# Altium schematic sheet ADE7753.SchDoc
size A4; SheetNumber: 3; SheetTotal: 6
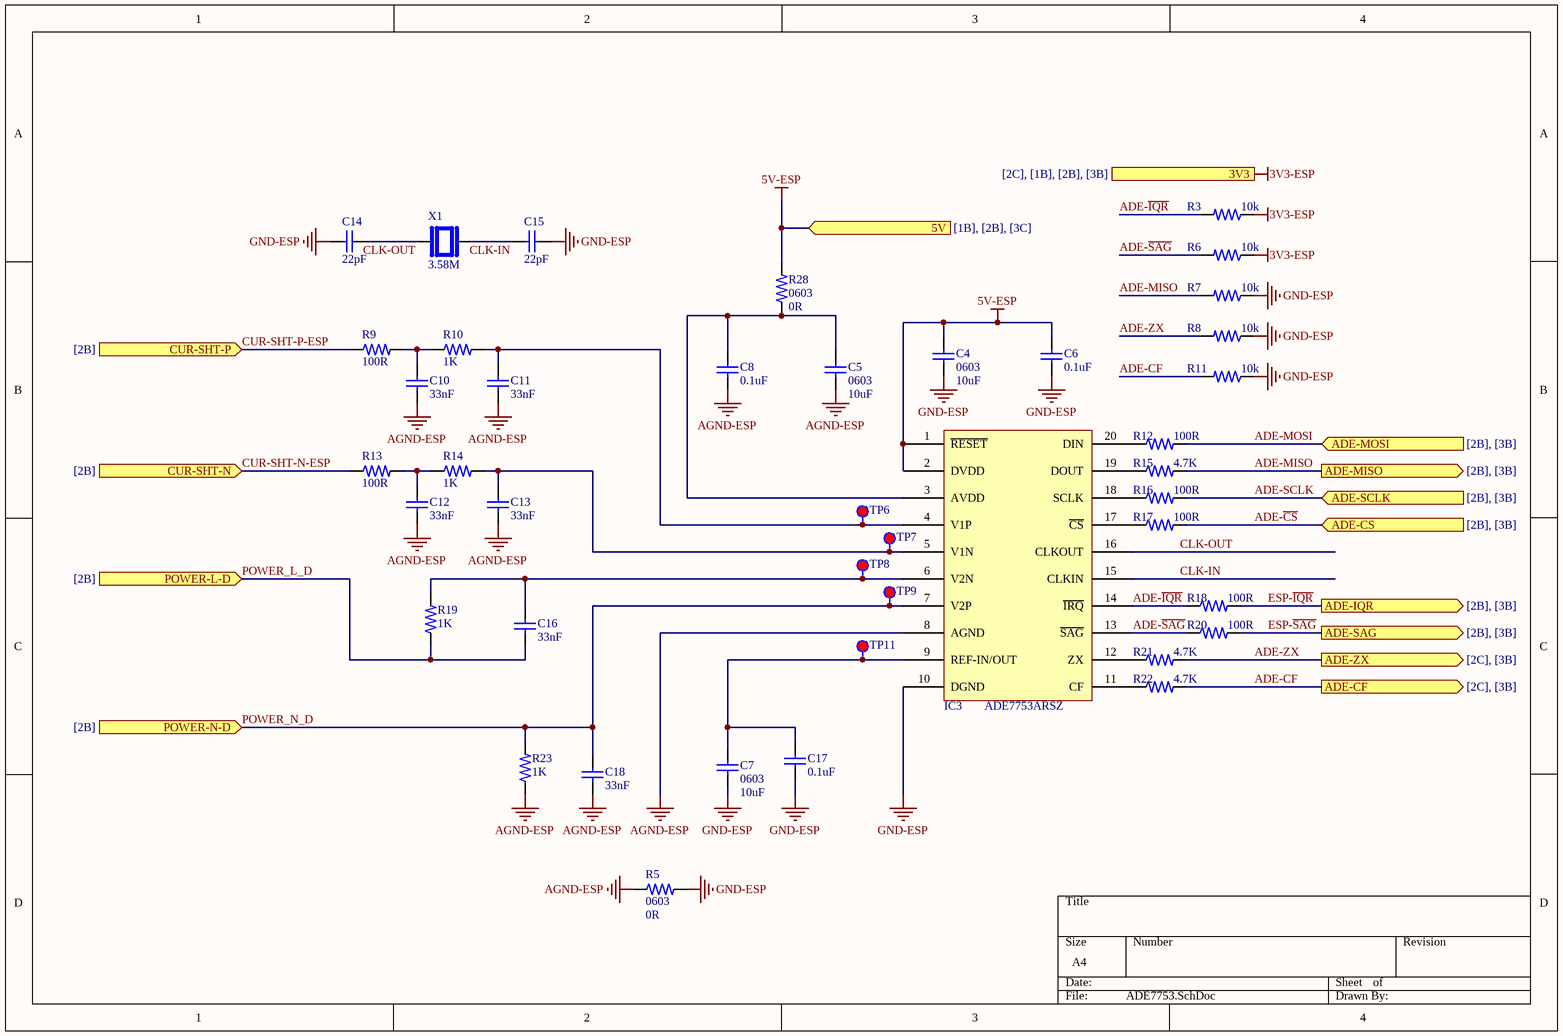
[diagram p0: ADE7753.SchDoc]

## Parts
C4  value 10uF  Package: 0603  [SMD-CAP-0603-YAGEO]  (hidden comment: 10 µF ±20% 25V Ceramic Capacitor X5R 0603 (1608 Metric))
C5  value 10uF  Package: 0603  [SMD-CAP-0603-YAGEO]  (hidden comment: 10 µF ±20% 25V Ceramic Capacitor X5R 0603 (1608 Metric))
C6  value 0.1uF  [SMD-CAP-0603-YAGEO]  (hidden comment: 0.1 µF ±10% 16V Ceramic Capacitor X7R 0603 (1608 Metric))
C7  value 10uF  Package: 0603  [SMD-CAP-0603-YAGEO]  (hidden comment: 10 µF ±20% 25V Ceramic Capacitor X5R 0603 (1608 Metric))
C8  value 0.1uF  [SMD-CAP-0603-YAGEO]  (hidden comment: 0.1 µF ±10% 16V Ceramic Capacitor X7R 0603 (1608 Metric))
C10  value 33nF  [SMD-CAP-0603-KEMET]  (hidden comment: 0.033 µF ±5% 16V Ceramic Capacitor X7R 0603 (1608 Metric))
C11  value 33nF  [SMD-CAP-0603-KEMET]  (hidden comment: 0.033 µF ±5% 16V Ceramic Capacitor X7R 0603 (1608 Metric))
C12  value 33nF  [SMD-CAP-0603-KEMET]  (hidden comment: 0.033 µF ±5% 16V Ceramic Capacitor X7R 0603 (1608 Metric))
C13  value 33nF  [SMD-CAP-0603-KEMET]  (hidden comment: 0.033 µF ±5% 16V Ceramic Capacitor X7R 0603 (1608 Metric))
C14  value 22pF  [SMD-CAP-0603-YAGEO]  (hidden comment: 22 pF ±1% 50V Ceramic Capacitor C0G, NP0 0603 (1608 Metric))
C15  value 22pF  [SMD-CAP-0603-YAGEO]  (hidden comment: 22 pF ±1% 50V Ceramic Capacitor C0G, NP0 0603 (1608 Metric))
C16  value 33nF  [SMD-CAP-0603-KEMET]  (hidden comment: 0.033 µF ±5% 16V Ceramic Capacitor X7R 0603 (1608 Metric))
C17  value 0.1uF  [SMD-CAP-0603-YAGEO]  (hidden comment: 0.1 µF ±10% 16V Ceramic Capacitor X7R 0603 (1608 Metric))
C18  value 33nF  [SMD-CAP-0603-KEMET]  (hidden comment: 0.033 µF ±5% 16V Ceramic Capacitor X7R 0603 (1608 Metric))
IC3  Single Phase Meter IC 20-SSOP  [SSOP-20-ADI]  (value not drawn)
R3  value 10k  [SMD-RES-0603-SEI]  (hidden comment: 10 kOhms ±1% 0.25W, 1/4W Chip Resistor 0603 (1608 Metric) Automotive AEC-Q200, Pulse Withstanding Thick Film)
R5  value 0R  Package: 0603  [SMD-RES-0603-SEI]  (hidden comment: 0 Ohms Jumper Chip Resistor 0603 (1608 Metric) Automotive AEC-Q200 Thick Film)
R6  value 10k  [SMD-RES-0603-SEI]  (hidden comment: 10 kOhms ±1% 0.25W, 1/4W Chip Resistor 0603 (1608 Metric) Automotive AEC-Q200, Pulse Withstanding Thick Film)
R7  value 10k  [SMD-RES-0603-SEI]  (hidden comment: 10 kOhms ±1% 0.25W, 1/4W Chip Resistor 0603 (1608 Metric) Automotive AEC-Q200, Pulse Withstanding Thick Film)
R8  value 10k  [SMD-RES-0603-SEI]  (hidden comment: 10 kOhms ±1% 0.25W, 1/4W Chip Resistor 0603 (1608 Metric) Automotive AEC-Q200, Pulse Withstanding Thick Film)
R9  value 100R  [SMD-RES-0603-RS]  (hidden comment: 100 Ohms ±1% 0.1W, 1/10W Chip Resistor 0603 (1608 Metric) Automotive AEC-Q200, High Voltage Thick Film)
R10  value 1K  [SMD-RES-0603-SEI]  (hidden comment: 1 kOhms ±1% 0.25W, 1/4W Chip Resistor 0603 (1608 Metric) Automotive AEC-Q200, Pulse Withstanding Thick Film)
R11  value 10k  [SMD-RES-0603-SEI]  (hidden comment: 10 kOhms ±1% 0.25W, 1/4W Chip Resistor 0603 (1608 Metric) Automotive AEC-Q200, Pulse Withstanding Thick Film)
R12  value 100R  [SMD-RES-0603-RS]  (hidden comment: 100 Ohms ±1% 0.1W, 1/10W Chip Resistor 0603 (1608 Metric) Automotive AEC-Q200, High Voltage Thick Film)
R13  value 100R  [SMD-RES-0603-RS]  (hidden comment: 100 Ohms ±1% 0.1W, 1/10W Chip Resistor 0603 (1608 Metric) Automotive AEC-Q200, High Voltage Thick Film)
R14  value 1K  [SMD-RES-0603-SEI]  (hidden comment: 1 kOhms ±1% 0.25W, 1/4W Chip Resistor 0603 (1608 Metric) Automotive AEC-Q200, Pulse Withstanding Thick Film)
R15  value 4.7K  [SMD-RES-0603-RS]  (hidden comment: 4.7 kOhms ±1% 0.1W, 1/10W Chip Resistor 0603 (1608 Metric) Anti-Sulfur Thick Film)
R16  value 100R  [SMD-RES-0603-RS]  (hidden comment: 100 Ohms ±1% 0.1W, 1/10W Chip Resistor 0603 (1608 Metric) Automotive AEC-Q200, High Voltage Thick Film)
R17  value 100R  [SMD-RES-0603-RS]  (hidden comment: 100 Ohms ±1% 0.1W, 1/10W Chip Resistor 0603 (1608 Metric) Automotive AEC-Q200, High Voltage Thick Film)
R18  value 100R  [SMD-RES-0603-RS]  (hidden comment: 100 Ohms ±1% 0.1W, 1/10W Chip Resistor 0603 (1608 Metric) Automotive AEC-Q200, High Voltage Thick Film)
R19  value 1K  [SMD-RES-0603-SEI]  (hidden comment: 1 kOhms ±1% 0.25W, 1/4W Chip Resistor 0603 (1608 Metric) Automotive AEC-Q200, Pulse Withstanding Thick Film)
R20  value 100R  [SMD-RES-0603-RS]  (hidden comment: 100 Ohms ±1% 0.1W, 1/10W Chip Resistor 0603 (1608 Metric) Automotive AEC-Q200, High Voltage Thick Film)
R21  value 4.7K  [SMD-RES-0603-RS]  (hidden comment: 4.7 kOhms ±1% 0.1W, 1/10W Chip Resistor 0603 (1608 Metric) Anti-Sulfur Thick Film)
R22  value 4.7K  [SMD-RES-0603-RS]  (hidden comment: 4.7 kOhms ±1% 0.1W, 1/10W Chip Resistor 0603 (1608 Metric) Anti-Sulfur Thick Film)
R23  value 1K  [SMD-RES-0603-SEI]  (hidden comment: 1 kOhms ±1% 0.25W, 1/4W Chip Resistor 0603 (1608 Metric) Automotive AEC-Q200, Pulse Withstanding Thick Film)
R28  value 0R  Package: 0603  [SMD-RES-0603-SEI]  (hidden comment: 0 Ohms Jumper Chip Resistor 0603 (1608 Metric) Automotive AEC-Q200 Thick Film)
TP6  Test Point  [TEST_POINT]  (value not drawn)
TP7  Test Point  [TEST_POINT]  (value not drawn)
TP8  Test Point  [TEST_POINT]  (value not drawn)
TP9  Test Point  [TEST_POINT]  (value not drawn)
TP11  Test Point  [TEST_POINT]  (value not drawn)
X1  value 3.58M  [SMD-HC-49/US-ALLC]  (hidden comment: 3.579545 MHz ±20ppm Crystal 18pF 180 Ohms HC-49/US)

## Ports
3V3 (in, see [2C], [1B], [2B], [3B]), 5V (in, see [1B], [2B], [3C]), ADE-CF (out, see [2C], [3B]), ADE-CS (in, see [2B], [3B]), ADE-IQR (out, see [2B], [3B]), ADE-MISO (out, see [2B], [3B]), ADE-MOSI (in, see [2B], [3B]), ADE-SAG (out, see [2B], [3B]), ADE-SCLK (in, see [2B], [3B]), ADE-ZX (out, see [2C], [3B]), CUR-SHT-N (in, see [2B]), CUR-SHT-P (in, see [2B]), POWER-L-D (in, see [2B]), POWER-N-D (in, see [2B])

## Nets
3V3-ESP: R3.1 R6.1 ; port 3V3
5V-ESP: C4.2 C6.2 IC3.1(~{RESET}) IC3.2(DVDD) R28.2 ; port 5V
AGND-ESP: C5.1 C8.1 C10.1 C11.1 C12.1 C13.1 C18.1 IC3.8(AGND) R5.1 R23.1
GND-ESP: C4.1 C6.1 C7.1 C14.1 C15.2 C17.1 IC3.10(DGND) R5.2 R7.1 R8.1 R11.1
ADE-~{CS}: R17.2 ; port ADE-CS
ADE-CF: R11.2 R22.2 ; port ADE-CF
ADE-~{IQR}: IC3.14(~{IRQ}) R3.2 R18.1
ADE-MISO: R7.2 R15.2 ; port ADE-MISO
ADE-MOSI: R12.2 ; port ADE-MOSI
ADE-~{SAG}: IC3.13(~{SAG}) R6.2 R20.1
ADE-SCLK: R16.2 ; port ADE-SCLK
ADE-ZX: R8.2 R21.2 ; port ADE-ZX
CLK-IN: C15.1 IC3.15(CLKIN) X1.2
CLK-OUT: C14.2 IC3.16(CLKOUT) X1.1
CUR-SHT-N-ESP: R13.1 ; port CUR-SHT-N
CUR-SHT-P-ESP: R9.1 ; port CUR-SHT-P
ESP-~{IQR}: R18.2 ; port ADE-IQR
ESP-~{SAG}: R20.2 ; port ADE-SAG
POWER_L_D: C16.1 R19.1 ; port POWER-L-D
POWER_N_D: C18.2 IC3.7(V2P) R23.2 TP9.1 ; port POWER-N-D
NetC5_2: C5.2 C8.2 IC3.3(AVDD) R28.1
NetC7_2: C7.2 C17.2 IC3.9(REF-IN/OUT) TP11.1
NetC10_2: C10.2 R9.2 R10.1
NetC11_2: C11.2 IC3.4(V1P) R10.2 TP6.1
NetC12_2: C12.2 R13.2 R14.1
NetC13_2: C13.2 IC3.5(V1N) R14.2 TP7.1
NetC16_2: C16.2 IC3.6(V2N) R19.2 TP8.1
NetIC3_11: IC3.11(CF) R22.1
NetIC3_12: IC3.12(ZX) R21.1
NetIC3_17: IC3.17(~{CS}) R17.1
NetIC3_18: IC3.18(SCLK) R16.1
NetIC3_19: IC3.19(DOUT) R15.1
NetIC3_20: IC3.20(DIN) R12.1

## Library data of the parts
C4 C5 C7 = CAP; 10uF; 25V; SMD; 0603; CC0603MRX5R8BB106: Multilayer Ceramic Capacitor, 10 uF, 25 V, ï¿½ 20%, X5R, 0603 [1608 Metric]; Manufacturer: Yageo; Designer: TVBac; Supplier: Future Electronics; Supplier Part Number: 3086968; Manufacturer Part Number: CC0603MRX5R8BB106; RoHS: Yes; Category: Ceramic Capacitors; Stock: 296000; Pricing: 4000=0.155, 8000=0.153, 12000=0.151 (USD); Mounting Technology: Surface Mount; Case/Package: 0603; Case Code (Imperial): 0603; Case Code (Metric): 1608; Min Operating Temperature: -55°C; Max Operating Temperature: 85°C; Packaging: Cut Tape; Tolerance: 20%; Voltage Rating: 25V; Series: CC; Dielectric: X5R; Voltage Rating (DC): 25V; RoHS Compliant: Yes; Halogen Free: Halogen Free; Lead Free: Lead Free; ComponentLink1URL: https://www.yageo.com/upload/media/product/productsearch/datasheet/mlcc/UPY-GPHC_X5R_4V-to-50V_26.pdf?src-supplier=Digikey; ComponentLink1Description: https://www.yageo.com/upload/media/product/productsearch/datasheet/mlcc/UPY-GPHC_X5R_4V-to-50V_26.pdf?src-supplier=Digikey; ComponentLink2URL: https://datasheet.octopart.com/CC0603MRX5R8BB106-Yageo-datasheet-182965619.pdf?src-supplier=Farnell; ComponentLink2Description: https://datasheet.octopart.com/CC0603MRX5R8BB106-Yageo-datasheet-182965619.pdf?src-supplier=Farnell; ComponentLink3Description: Link Digikey; ComponentLink3URL: https://www.digikey.com/en/products/detail/yageo/CC0603MRX5R8BB106/7164378
C6 C8 C17 = CAP; 0.1uF; 16V; 0603; SMD; CC0603KRX7R7BB104: 0603 0.1 uF 16 V ±10 % Tolerance X7R SMT Multilayer Ceramic Capacitor; Manufacturer: Yageo; Insulation Resistance: 100GR; Designer: TVBac; Supplier: Digikey; Supplier Part Number: 311-1088-1-ND; Manufacturer Part Number: CC0603KRX7R7BB104; RoHS: Yes; Category: Ceramic Capacitors; Stock: 8705780; Pricing: 1=0.1, 10=0.042, 50=0.0238, 100=0.0185, 500=0.01392, 1000=0.01094, 4000=0.00915, 8000=0.00836, 12000=0.00796, 28000=0.00756, 100000=0.00547, 200000=0.00529, 400000=0.00497 (USD); Mounting Technology: Surface Mount; Case/Package: 0603; Pins: 2; Case Code (Metric): 1608; Case Code (Imperial): 0603; Material: Ceramic; Min Operating Temperature: -55°C; Max Operating Temperature: 125°C; Voltage Rating: 16V; Tolerance: 10%; Voltage Rating (DC): 16V; Package Quantity: 1; Packaging: Tape and Reel; Dielectric: X7R; Termination: SMD/SMT; Voltage: 16V; Series: CC; Length: 1.6mm; Width: 0.031inch; Height: 0.8mm; Thickness: 0.035inch; Depth: 0.8mm; Radiation Hardening: No; Reach SVHC Compliant: No; Lead Free: Lead Free; Halogen Free: Halogen Free; RoHS Compliant: Yes; ComponentLink1URL: https://datasheet.ciiva.com/11786/0900766b80d84f1d-11786077.pdf?src-supplier=Rs; ComponentLink1Description: https://datasheet.ciiva.com/11786/0900766b80d84f1d-11786077.pdf?src-supplier=Rs; ComponentLink2URL: https://datasheet.ciiva.com/8033/70765-8033799.pdf?src-supplier=Element14; ComponentLink2Description: https://datasheet.ciiva.com/8033/70765-8033799.pdf?src-supplier=Element14; ComponentLink3URL: https://datasheet.ciiva.com/7978/1489800-7978141.pdf?src-supplier=Element14; ComponentLink3Description: https://datasheet.ciiva.com/7978/1489800-7978141.pdf?src-supplier=Element14; ComponentLink4URL: https://datasheet.ciiva.com/28450/1489800-28450552.pdf?src-supplier=Element14; ComponentLink4Description: https://datasheet.ciiva.com/28450/1489800-28450552.pdf?src-supplier=Element14; ComponentLink5URL: https://datasheet.ciiva.com/46430/1734573-46430156.pdf?src-supplier=Element14; ComponentLink5Description: https://datasheet.ciiva.com/46430/1734573-46430156.pdf?src-supplier=Element14; ComponentLink6URL: https://datasheet.ciiva.com/144/mlccorderingcode-144183.pdf?src-supplier=Digikey; ComponentLink6Description: https://datasheet.ciiva.com/144/mlccorderingcode-144183.pdf?src-supplier=Digikey; ComponentLink7URL: https://datasheet.ciiva.com/144/mlccorderingcode-144182.pdf?src-supplier=Digikey; ComponentLink7Description: https://datasheet.ciiva.com/144/mlccorderingcode-144182.pdf?src-supplier=Digikey; ComponentLink8URL: https://datasheet.ciiva.com/144/mlccorderingcode-144184.pdf?src-supplier=Digikey; ComponentLink8Description: https://datasheet.ciiva.com/144/mlccorderingcode-144184.pdf?src-supplier=Digikey; ComponentLink9URL: https://datasheet.ciiva.com/8033/1734573-8033797.pdf?src-supplier=Element14; ComponentLink9Description: https://datasheet.ciiva.com/8033/1734573-8033797.pdf?src-supplier=Element14; ComponentLink10URL: https://datasheet.ciiva.com/13395/upy-gphc-x7r-6-3v-to-50v-8-13395674.pdf?src-supplier=Mouser; ComponentLink10Description: https://datasheet.ciiva.com/13395/upy-gphc-x7r-6-3v-to-50v-8-13395674.pdf?src-supplier=Mouser; ComponentLink11URL: https://datasheet.ciiva.com/11464/upy-gphc-x7r-6-3v-to-50v-8-11464735.pdf?src-supplier=Avnet; ComponentLink11Description: https://datasheet.ciiva.com/11464/upy-gphc-x7r-6-3v-to-50v-8-11464735.pdf?src-supplier=Avnet; ComponentLink12URL: https://datasheet.ciiva.com/15165/getdatasheetpartid-63554-15165387.pdf?src-supplier=Verical; ComponentLink12Description: https://datasheet.ciiva.com/15165/getdatasheetpartid-63554-15165387.pdf?src-supplier=Verical; ComponentLink13Description: Link Digikey; ComponentLink13URL: https://www.digikey.com/en/products/detail/yageo/CC0603KRX7R7BB104/302822
C10-C13 C16 C18 = CAP; 0.033uF; 33nF; 0603; 16V; C0603C333J4REC7411: Multilayer Ceramic Capacitors MLCC - SMD/SMT 16V 0.033uF X7R 0603 5%; Manufacturer: KEMET; Designer: TVBac; Supplier: Mouser; Supplier Part Number: 80-C0603C333J4RECLR; Manufacturer Part Number: C0603C333J4REC7411; RoHS: Yes; Category: Ceramic Capacitors; Stock: 17910; Pricing: 1=0.13, 10=0.057, 50=0.057, 100=0.033, 1000=0.025, 2500=0.022, 10000=0.02, 15000=0.018, 45000=0.017, 90000=0.014 (USD); ComponentLink1URL: https://api.kemet.com/component-edge/download/datasheet/C0603C333J4REC7411.pdf?src-supplier=Digikey; ComponentLink1Description: https://api.kemet.com/component-edge/download/datasheet/C0603C333J4REC7411.pdf?src-supplier=Digikey; ComponentLink2Description: Link Digikey; ComponentLink2URL: https://www.digikey.com/en/products/detail/kemet/C0603C333J4REC7411/8645086
C14 C15 = CAP; 22pF; 50V; SMD; CC0603FRNPO9BN220: Multilayer Ceramic Capacitor, 22 pF, 50 V, ï¿½ 1%, C0G (NP0), 0603 [1608 Metric]; Manufacturer: Yageo; Designer: TVBac; Supplier: Future Electronics; Supplier Part Number: 1000074; Manufacturer Part Number: CC0603FRNPO9BN220; RoHS: Yes; Category: Ceramic Capacitors; Stock: 144000; Pricing: 4000=0.0159, 12000=0.0156, 20000=0.0154, 80000=0.0149, 120000=0.0147 (USD); Lead Free: 5697LeadFree; Halogen Free: 5694HalogenFree; ComponentLink1URL: https://datasheet.ciiva.com/13211/upy-gp-np0-16v-to-50v-8-13211061.pdf?src-supplier=Mouser; ComponentLink1Description: https://datasheet.ciiva.com/13211/upy-gp-np0-16v-to-50v-8-13211061.pdf?src-supplier=Mouser; ComponentLink2Description: Link Digikey; ComponentLink2URL: https://www.digikey.com/en/products/detail/yageo/CC0603FRNPO9BN220/5883497
IC3 = ADE7753ARSZ: Single Phase Multifunction Metering IC 20-Pin SSOP Tube; Manufacturer: Analog Devices; Designer: TVBac; Supplier: Mouser; Supplier Part Number: 584-ADE7753ARSZ; Manufacturer Part Number: ADE7753ARSZ; RoHS: Yes; Category: Analog to Digital Converters (ADCs); Stock: 239; Pricing: 1=7.3, 10=5.71, 50=5.04, 100=3.91, 1000=3.51, 10000=3.37 (USD); ComponentLink1URL: https://datasheet.ciiva.com/15373/ade7753-249340-15373717.pdf?src-supplier=Mouser; ComponentLink1Description: https://datasheet.ciiva.com/15373/ade7753-249340-15373717.pdf?src-supplier=Mouser; ComponentLink2URL: https://datasheet.ciiva.com/1166/1610806-1166771.pdf?src-supplier=Element14; ComponentLink2Description: https://datasheet.ciiva.com/1166/1610806-1166771.pdf?src-supplier=Element14; ComponentLink3URL: https://datasheet.ciiva.com/15134/getdatasheetpartid-132040-15134272.pdf?src-supplier=Verical; ComponentLink3Description: https://datasheet.ciiva.com/15134/getdatasheetpartid-132040-15134272.pdf?src-supplier=Verical; ComponentLink4URL: https://datasheet.ciiva.com/1941/ade7753-1941429.pdf?src-supplier=Digikey; ComponentLink4Description: https://datasheet.ciiva.com/1941/ade7753-1941429.pdf?src-supplier=Digikey; ComponentLink5URL: https://datasheet.ciiva.com/22621/1610806-22621637.pdf?src-supplier=Element14; ComponentLink5Description: https://datasheet.ciiva.com/22621/1610806-22621637.pdf?src-supplier=Element14; ComponentLink6URL: https://datasheet.ciiva.com/3148/ade7753-3148700.pdf?src-supplier=Avnet; ComponentLink6Description: https://datasheet.ciiva.com/3148/ade7753-3148700.pdf?src-supplier=Avnet; ComponentLink7URL: https://datasheet.ciiva.com/1168/1610806-1168083.pdf?src-supplier=Element14; ComponentLink7Description: https://datasheet.ciiva.com/1168/1610806-1168083.pdf?src-supplier=Element14; ComponentLink8URL: https://datasheet.ciiva.com/5697/ade7753-5697029.pdf?src-supplier=Farnell; ComponentLink8Description: https://datasheet.ciiva.com/5697/ade7753-5697029.pdf?src-supplier=Farnell; ComponentLink9URL: https://datasheet.ciiva.com/48694/001249930-da-01-en-ic-energy-meteri-ade7753arsz-ssop-20-adi-48694326.pdf?src-supplier=Conrad; ComponentLink9Description: https://datasheet.ciiva.com/48694/001249930-da-01-en-ic-energy-meteri-ade7753arsz-ssop-20-adi-48694326.pdf?src-supplier=Conrad; ComponentLink10Description: Link Digikey; ComponentLink10URL: https://www.digikey.com/en/products/detail/analog-devices-inc/ADE7753ARSZ/671181
R3 R6-R8 R11 = RES; 10K; 0603; SMD; ESR03EZPF1002: SMD Chip Resistor, 10 kOhm, ± 1%, 250 mW, 0603 [1608 Metric], Thick Film, Anti-Surge; Manufacturer: Rohm; Power Rating: 250mW; Temperature Coefficient: 100ppm/°C; Voltage Rating (DC): 150V; Designer: TVBac; Supplier: Digikey; Supplier Part Number: RHM10KADCT-ND; Manufacturer Part Number: ESR03EZPF1002; RoHS: Yes; Category: Chip SMD Resistors; Stock: 2136779; Pricing: 1=0.16, 10=0.078, 50=0.0516, 100=0.044, 500=0.03138, 1000=0.02764 (USD); Case/Package: 0603; Case Code (Metric): 1608; Case Code (Imperial): 0603; Min Operating Temperature: -55°C; Max Operating Temperature: 155°C; Tolerance: 1%; Package Quantity: 1; Packaging: Cut Tape; Number of Terminations: 2; Max Power Dissipation: 250mW; Features: Automotive AEC-Q200; Series: ESR; Length: 0.063inch; Width: 0.031inch; Height: 0.022inch; Ratings: AEC-Q200; RoHS Compliant: Yes; Lead Free: 5697LeadFree; ComponentLink1URL: https://datasheet.ciiva.com/2469/esr-2469710.pdf?src-supplier=Digikey; ComponentLink1Description: https://datasheet.ciiva.com/2469/esr-2469710.pdf?src-supplier=Digikey; ComponentLink2URL: https://datasheet.ciiva.com/2469/esr-2469711.pdf?src-supplier=Digikey; ComponentLink2Description: https://datasheet.ciiva.com/2469/esr-2469711.pdf?src-supplier=Digikey; ComponentLink3URL: https://datasheet.ciiva.com/2469/esr-2469709.pdf?src-supplier=Digikey; ComponentLink3Description: https://datasheet.ciiva.com/2469/esr-2469709.pdf?src-supplier=Digikey; ComponentLink4Description: Link Digikey; ComponentLink4URL: https://www.digikey.com/en/products/detail/rohm-semiconductor/ESR03EZPF1002/1983429
R5 R28 = RES; 0R; 0603; SMD;  RMCF0603ZT0R00: Res Thick 0603 0 Ohm Jumper 1/10W 100Ppm/ C Smd Rohs Compliant: Yes; Manufacturer: Stackpole Electronics; Max Power Dissipation: 100mW; Voltage Rating: 75V; Designer: TVBac; Supplier: Digikey; Supplier Part Number: RMCF0603ZT0R00CT-ND; Manufacturer Part Number: RMCF0603ZT0R00; RoHS: Yes; Category: Chip SMD Resistors; Stock: 5949380; Pricing: 1=0.1, 10=0.013, 25=0.0096, 50=0.0072, 100=0.0051, 250=0.00408, 500=0.00328, 1000=0.00241, 5000=0.00173, 10000=0.0015, 25000=0.00132, 50000=0.00121, 125000=0.00118 (USD); Mounting Technology: Surface Mount; Case/Package: 0603; Case Code (Metric): 1608; Case Code (Imperial): 0603; Contact Plating: Tin,Matte; Min Operating Temperature: -55°C; Max Operating Temperature: 155°C; Packaging: Tape and Reel; Number of Terminations: 2; Features: Automotive AEC-Q200; Series: RMCF; Construction: Rectangular; Length: 1.55mm; Width: 0.031inch; Height: 0.022inch; Depth: 0.8mm; Radiation Hardening: No; Lead Free: 5697LeadFree; Military Standard: Not; RoHS Compliant: Yes; ComponentLink1URL: https://datasheet.octopart.com/RMCF0603ZT0R00-Stackpole-Electronics-datasheet-11547379.pdf?src-supplier=Future+Electronics; ComponentLink1Description: https://datasheet.octopart.com/RMCF0603ZT0R00-Stackpole-Electronics-datasheet-11547379.pdf?src-supplier=Future+Electronics; ComponentLink2URL: https://www.seielect.com/catalog/SEI-Packaging.pdf?src-supplier=Avnet; ComponentLink2Description: https://www.seielect.com/catalog/SEI-Packaging.pdf?src-supplier=Avnet; ComponentLink3URL: https://www.seielect.com/catalog/SEI-Packaging.pdf?src-supplier=Arrow+Electronics; ComponentLink3Description: https://www.seielect.com/catalog/SEI-Packaging.pdf?src-supplier=Arrow+Electronics; ComponentLink4URL: https://www.seielect.com/catalog/SEI-Packaging.pdf?src-supplier=Verical; ComponentLink4Description: https://www.seielect.com/catalog/SEI-Packaging.pdf?src-supplier=Verical; ComponentLink5URL: https://www.seielect.com/Catalog/SEI-RMCF_RMCP.pdf?src-supplier=Digikey; ComponentLink5Description: https://www.seielect.com/Catalog/SEI-RMCF_RMCP.pdf?src-supplier=Digikey; ComponentLink6URL: https://www.seielect.com/catalog/SEI-Packaging.pdf?src-supplier=Digikey; ComponentLink6Description: https://www.seielect.com/catalog/SEI-Packaging.pdf?src-supplier=Digikey; ComponentLink7URL: https://datasheet.octopart.com/RMCF0603ZT0R00-Stackpole-Electronics-datasheet-154799224.pdf?src-supplier=Master+Electronics; ComponentLink7Description: https://datasheet.octopart.com/RMCF0603ZT0R00-Stackpole-Electronics-datasheet-154799224.pdf?src-supplier=Master+Electronics; ComponentLink8Description: Link Digikey; ComponentLink8URL: https://www.digikey.com/en/products/detail/stackpole-electronics-inc/RMCF0603ZT0R00/1756908
R9 R12 R13 R16-R18 R20 = RES; 100R; 0603; SMD; KTR03EZPF1000: Res Thick Film 0603 100 Ohm 1% 0.1W(1/10W) ±100ppm/C Pad SMD T/R Automotive AEC-Q200; Manufacturer: Rohm; Max Power Dissipation: 100mW; Temperature Coefficient: 100ppm/°C; Voltage Rating: 350V; Designer: TVBac; Supplier: Mouser; Supplier Part Number: 755-KTR03EZPF1000; Manufacturer Part Number: KTR03EZPF1000; RoHS: Yes; Category: Chip SMD Resistors; Stock: 66325; Pricing: 1=0.12, 10=0.039, 50=0.039, 100=0.024, 1000=0.021, 10000=0.015 (USD); Case/Package: 0603; Case Code (Metric): 1608; Case Code (Imperial): 0603; Min Operating Temperature: -55°C; Max Operating Temperature: 155°C; Packaging: Cut Tape; Tolerance: 1%; Number of Terminations: 2; Features: Automotive AEC-Q200; Series: KTR; Voltage Rating (DC): 350V; Ratings: AEC-Q200; RoHS Compliant: Yes; ComponentLink1URL: https://datasheet.ciiva.com/14926/ktr-14926472.pdf?src-supplier=Digikey; ComponentLink1Description: https://datasheet.ciiva.com/14926/ktr-14926472.pdf?src-supplier=Digikey; ComponentLink2URL: https://datasheet.ciiva.com/14932/ktr-14932133.pdf?src-supplier=Digikey; ComponentLink2Description: https://datasheet.ciiva.com/14932/ktr-14932133.pdf?src-supplier=Digikey; ComponentLink3Description: Link Digikey; ComponentLink3URL: https://www.digikey.com/en/products/detail/rohm-semiconductor/KTR03EZPF1000/4051558
R10 R14 R19 R23 = RES; 1K; 0603; SMD; ESR03EZPF1001: SMD Chip Resistor, 1 kOhm, ± 1%, 250 mW, 0603 [1608 Metric], Thick Film, Anti-Surge; Manufacturer: Rohm; Voltage Rating: 150V; Designer: TVBac; Supplier: Digikey; Supplier Part Number: RHM1.00KADCT-ND; Manufacturer Part Number: ESR03EZPF1001; RoHS: Yes; Category: Chip SMD Resistors; Stock: 2703233; Pricing: 1=0.11, 10=0.055, 50=0.0364, 100=0.0309, 500=0.02206, 1000=0.01943 (USD); Voltage Rating (DC): 150V; Lead Free: 5697LeadFree; ComponentLink1URL: https://datasheet.ciiva.com/2469/esr-2469712.pdf?src-supplier=Digikey; ComponentLink1Description: https://datasheet.ciiva.com/2469/esr-2469712.pdf?src-supplier=Digikey; ComponentLink2URL: https://datasheet.ciiva.com/2469/esr-2469713.pdf?src-supplier=Digikey; ComponentLink2Description: https://datasheet.ciiva.com/2469/esr-2469713.pdf?src-supplier=Digikey; ComponentLink3URL: https://datasheet.ciiva.com/2469/esr-2469714.pdf?src-supplier=Digikey; ComponentLink3Description: https://datasheet.ciiva.com/2469/esr-2469714.pdf?src-supplier=Digikey; ComponentLink4Description: Link Digikey; ComponentLink4URL: https://www.digikey.com/en/products/detail/rohm-semiconductor/ESR03EZPF1001/1983428
R15 R21 R22 = RES; 4.7K; 0603; SMD; SFR03EZPF4701: Res Anti-Sulfured Thick Film 0603 4.7k Ohm 1% 1/10W ±100ppm/°C Molded Paper T/R; Manufacturer: Rohm; Power Rating: 100mW; Voltage Rating (DC): 50V; Designer: TVBac; Supplier: Mouser; Supplier Part Number: 755-SFR03EZPF4701; Manufacturer Part Number: SFR03EZPF4701; RoHS: Yes; Category: Chip SMD Resistors; Stock: 30180; Pricing: 1=0.14, 10=0.045, 50=0.045, 100=0.027, 1000=0.02, 10000=0.014 (USD); ComponentLink1URL: http://www.farnell.com/datasheets/2611943.pdf?src-supplier=Farnell; ComponentLink1Description: http://www.farnell.com/datasheets/2611943.pdf?src-supplier=Farnell; ComponentLink2URL: http://www.farnell.com/datasheets/2611943.pdf?src-supplier=Newark; ComponentLink2Description: http://www.farnell.com/datasheets/2611943.pdf?src-supplier=Newark; ComponentLink3URL: http://www.farnell.com/datasheets/2611943.pdf?src-supplier=Element14; ComponentLink3Description: http://www.farnell.com/datasheets/2611943.pdf?src-supplier=Element14; ComponentLink4URL: https://www.rohm.com/datasheet/SFR03EZPF/sfr-e?src-supplier=Digikey; ComponentLink4Description: https://www.rohm.com/datasheet/SFR03EZPF/sfr-e?src-supplier=Digikey; ComponentLink5Description: Link Digikey; ComponentLink5URL: https://www.digikey.com/en/products/detail/rohm-semiconductor/SFR03EZPF4701/9771855
TP6-TP9 TP11 = TEST_POINT
X1 = OSC; 3.58M; 3.579545M; ABLS-3.579545MHZ-B2-T: Crystal 3.579545MHz ±20ppm (Tol) ±50ppm (Stability) 18pF FUND 180Ohm 2-Pin HC-49/US SMD T/R; Manufacturer: Abracon; Designer: TVBac; Supplier: Digikey; Supplier Part Number: 535-9081-1-ND; Manufacturer Part Number: ABLS-3.579545MHZ-B2-T; RoHS: Yes; Category: Crystals; Stock: 16401; Pricing: 1=0.27, 10=0.231, 50=0.208, 100=0.1989, 500=0.17934, 1000=0.17152, 2000=0.16407, 3000=0.15987, 5000=0.15474, 7000=0.15146, 10000=0.14806, 25000=0.13969, 50000=0.13369 (USD); ComponentLink1URL: https://datasheet.ciiva.com/15116/getdatasheetpartid-719903-15116782.pdf?src-supplier=Verical; ComponentLink1Description: https://datasheet.ciiva.com/15116/getdatasheetpartid-719903-15116782.pdf?src-supplier=Verical; ComponentLink2URL: https://datasheet.ciiva.com/16410/abls-16410837.pdf?src-supplier=Future+Electronics; ComponentLink2Description: https://datasheet.ciiva.com/16410/abls-16410837.pdf?src-supplier=Future+Electronics; ComponentLink3URL: https://datasheet.ciiva.com/854/abls-854273.pdf?src-supplier=Digikey; ComponentLink3Description: https://datasheet.ciiva.com/854/abls-854273.pdf?src-supplier=Digikey; ComponentLink4URL: https://datasheet.ciiva.com/854/abls-854274.pdf?src-supplier=Digikey; ComponentLink4Description: https://datasheet.ciiva.com/854/abls-854274.pdf?src-supplier=Digikey; ComponentLink5URL: https://datasheet.ciiva.com/854/abls-854275.pdf?src-supplier=Digikey; ComponentLink5Description: https://datasheet.ciiva.com/854/abls-854275.pdf?src-supplier=Digikey; ComponentLink6URL: https://datasheet.ciiva.com/4945/abls-44621-4945006.pdf?src-supplier=Mouser; ComponentLink6Description: https://datasheet.ciiva.com/4945/abls-44621-4945006.pdf?src-supplier=Mouser; ComponentLink7URL: https://datasheet.ciiva.com/7998/abls-7998431.pdf?src-supplier=Element14; ComponentLink7Description: https://datasheet.ciiva.com/7998/abls-7998431.pdf?src-supplier=Element14; ComponentLink8Description: Link Digikey; ComponentLink8URL: https://www.digikey.com/en/products/detail/abracon-llc/ABLS-3-579545MHZ-B2-T/675276